# Altium project Audio Prj.PrjPcb
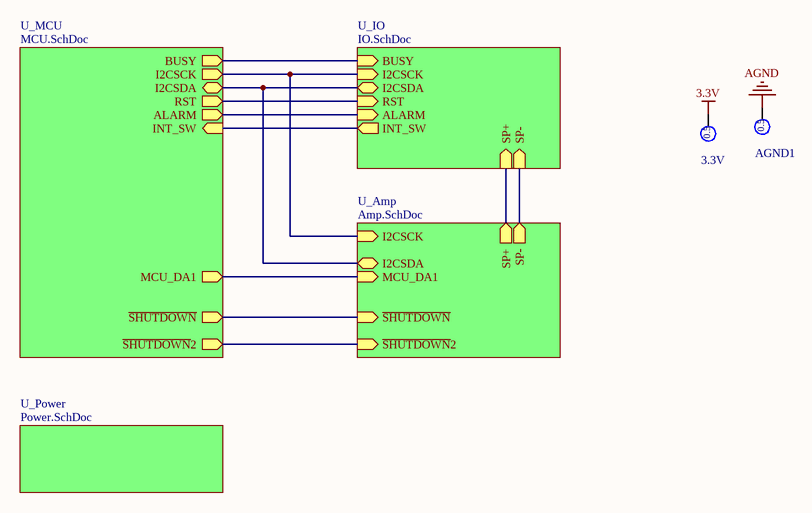
[diagram p0: TOP.SchDoc]
PRJ_Number: 202107; PRJ_Title: IHA-8001; SCH_Rev: 1.0
4 sheets, 186 parts. Net scope: hierarchical (ports join the sheet entries above them; power ports are global).
Board file: PCB2.PcbDoc
Sheets:
  TOP.SchDoc
    U_Amp = Amp.SchDoc
    U_Power = Power.SchDoc
    U_IO = IO.SchDoc

## Sheet TOP.SchDoc: CX1000 5V4A
size A4; Date: 2012/02/27; ApprovedBy: 稲村; DrawnBy: 猪鼻; DocumentNumber: Documentnumber; Revision: 1; SheetNumber: 1; SheetTotal: 5; BoardNumber: BoardNumber; PartsNumber: PartsNumber; DrawnDate: 2012/02/27; ApprovedDate: 2012/**/**

### Parts
3.3V  TP0.5mm  [TP0.5mm]  (value not drawn)  (no BOM)
AGND1  TP0.5mm  [TP0.5mm]  (value not drawn)  (no BOM)

### Sub-sheets
U_Amp = Amp.SchDoc: SP+ (out), SP- (out), MCU_DA1 (in), ~{SHUTDOWN} (in), I2CSCK (in), I2CSDA (bidir), ~{SHUTDOWN}2 (in)
U_IO = IO.SchDoc: SP+ (in), SP- (in), BUSY (in), I2CSCK (in), I2CSDA (bidir), INT_SW (out), RST (in), ALARM (in)
U_MCU = MCU.SchDoc (file not in this document): I2CSCK (out), I2CSDA (bidir), ALARM (out), BUSY (out), MCU_DA1 (out), RST (out), INT_SW (in), ~{SHUTDOWN} (out), ~{SHUTDOWN}2 (out)
U_Power = Power.SchDoc: no entries

### Nets
3.3V: 3.3V.1
AGND: AGND1.1
ALARM: sheet U_MCU/ALARM, sheet U_IO/ALARM
BUSY: sheet U_MCU/BUSY, sheet U_IO/BUSY
I2CSCK: sheet U_Amp/I2CSCK, sheet U_MCU/I2CSCK, sheet U_IO/I2CSCK
I2CSDA: sheet U_Amp/I2CSDA, sheet U_MCU/I2CSDA, sheet U_IO/I2CSDA
SP+: sheet U_Amp/SP+, sheet U_IO/SP+
SP-: sheet U_Amp/SP-, sheet U_IO/SP-
NetC58_1: sheet U_Amp/MCU_DA1, sheet U_MCU/MCU_DA1
NetR123_1: sheet U_Amp/~{SHUTDOWN}2, sheet U_MCU/~{SHUTDOWN}2
NetTR3_B: sheet U_Amp/~{SHUTDOWN}, sheet U_MCU/~{SHUTDOWN}
NetU6_14: sheet U_MCU/RST, sheet U_IO/RST
NetU6_16: sheet U_MCU/INT_SW, sheet U_IO/INT_SW

### Notes on the sheet
- Project Title:
- Project No:
- Size:
- Date:
- A4
- Rev:
- Page Title:
- Sheet:
- of
- (in symbol TP0.5mm) 0.5

### Library data of the parts
3.3V AGND1 = TP0.5mm: Test-Point 0.5mm

## Sheet Amp.SchDoc
size A4; SheetNumber: 4; SheetTotal: 5
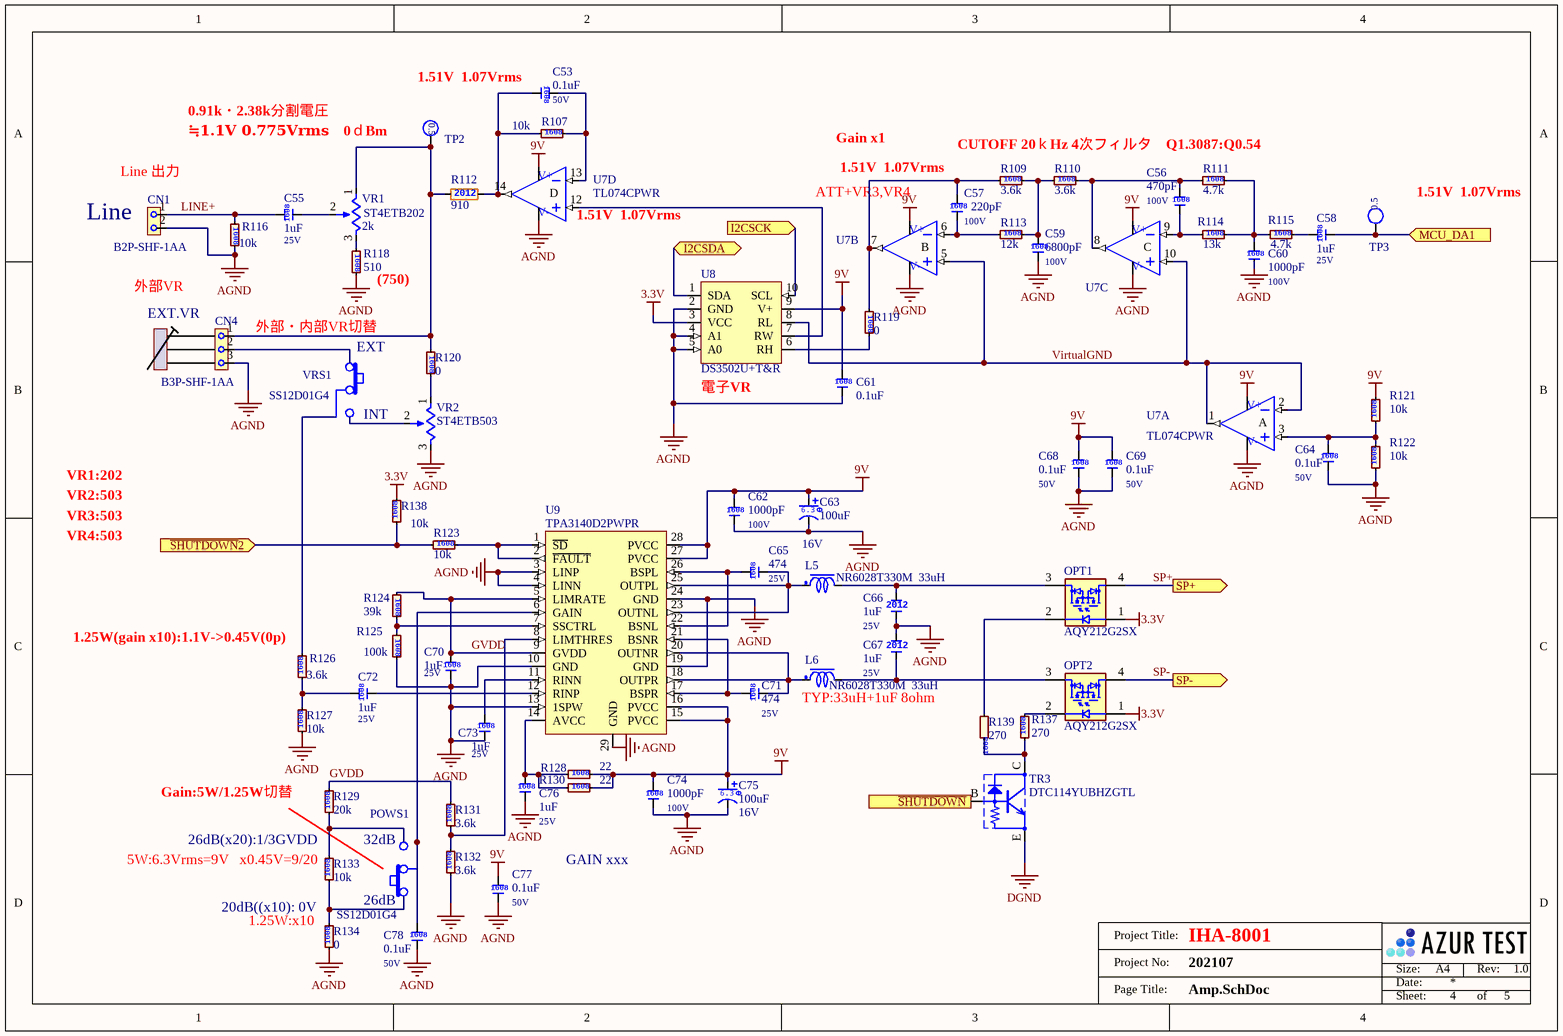
[diagram p1: Amp.SchDoc]

### Parts
C53  Tag: 0.1uF  Voltage: 50V  [C1608]  (hidden comment: CGA3E2X7R1H104K080AA)
C55  Tag: 1uF  Voltage: 25V  [C1608]  (hidden comment: TMK107BJ105MA-T)
C56  Tag: 470pF  Voltage: 100V  [C1608]  (hidden comment: GCM1885C2A471JA16D)
C57  Tag: 220pF  Voltage: 100V  [C1608]  (hidden comment: GCM1885C2A221JA16D)
C58  Tag: 1uF  Voltage: 25V  [C1608]  (hidden comment: TMK107BJ105MA-T)
C59  Tag: 6800pF  Voltage: 100V  [C1608]  (hidden comment: GCM1885C2A682JA16D)
C60  Tag: 1000pF  Voltage: 100V  [C1608]  (hidden comment: GCM1885C2A102JA16D)
C61  Tag: 0.1uF  [C1608]  (hidden comment: CGA3E2X7R1H104K080AA)
C62  Tag: 1000pF  Voltage: 100V  [C1608]  (hidden comment: GCM1885C2A102JA16D)
C63  Tag: 100uF  Voltage: 16V  [6.6mmX6.6mm]  (hidden comment: UCQ1C101MCL1GS)
C64  Tag: 0.1uF  Voltage: 50V  [C1608]  (hidden comment: CGA3E2X7R1H104K080AA)
C65  Tag: 474  Voltage: 25V  [C1608]  (hidden comment: UMK107B7474KA-TR)
C66  Tag: 1uF  Voltage: 25V  [C2012]  (hidden comment: TMK212BJ105KG-T)
C67  Tag: 1uF  Voltage: 25V  [C2012]  (hidden comment: TMK212BJ105KG-T)
C68  Tag: 0.1uF  Voltage: 50V  [C1608]  (hidden comment: CGA3E2X7R1H104K080AA)
C69  Tag: 0.1uF  Voltage: 50V  [C1608]  (hidden comment: CGA3E2X7R1H104K080AA)
C70  Tag: 1uF  Voltage: 25V  [C1608]  (hidden comment: TMK107BJ105MA-T)
C71  Tag: 474  Voltage: 25V  [C1608]  (hidden comment: UMK107B7474KA-TR)
C72  Tag: 1uF  Voltage: 25V  [C1608]  (hidden comment: TMK107BJ105MA-T)
C73  Tag: 1uF  Voltage: 25V  [C1608]  (hidden comment: TMK107BJ105MA-T)
C74  Tag: 1000pF  Voltage: 100V  [C1608]  (hidden comment: GCM1885C2A102JA16D)
C75  Tag: 100uF  Voltage: 16V  [6.6mmX6.6mm]  (hidden comment: UCQ1C101MCL1GS)
C76  Tag: 1uF  Voltage: 25V  [C1608]  (hidden comment: TMK107BJ105MA-T)
C77  Tag: 0.1uF  Voltage: 50V  [C1608]  (hidden comment: CGA3E2X7R1H104K080AA)
C78  Tag: 0.1uF  Voltage: 50V  [C1608]  (hidden comment: CGA3E2X7R1H104K080AA)
CN1  B2P-SHF-1AA  [B2P-SHF-1AA]
CN4  B3P-SHF-1AA  [B3P-SHF-1AA]
L5  NR6028T330M  33uH  [NR6028T]
L6  NR6028T330M  33uH  [NR6028T]
OPT1  AQY212G2SX  [SOP4-2.54]
OPT2  AQY212G2SX  [SOP4-2.54]
POWS1  SS12D01G4  [SS12D01G4]
R107  Tag: 10k  [R1608]  (hidden comment: ERJ-PA3F1002V)
R109  Tag: 3.6k  [R1608]  (hidden comment: ERJ-PA3F3601V)
R110  Tag: 3.6k  [R1608]  (hidden comment: ERJ-PA3F3601V)
R111  Tag: 4.7k  [R1608]  (hidden comment: ERJ-PA3F4701V)
R112  Tag: 910  [R2012]  (hidden comment: RK73B2ATTD911J)
R113  Tag: 12k  [R1608]  (hidden comment: ERJ-PA3F1201V)
R114  Tag: 13k  [R1608]  (hidden comment: ERJ-PA3F1302V)
R115  Tag: 4.7k  [R1608]  (hidden comment: ERJ-PA3F4701V)
R116  Tag: 10k  [R1608]  (hidden comment: ERJ-PA3F1002V)
R118  Tag: 510  [R1608]  (hidden comment: ERJ-PA3F5100V)
R119  Tag: 0  [R1608]  (hidden comment: RK73Z1JTTD)
R120  Tag: 0  [R1608]  (hidden comment: RK73Z1JTTD)
R121  Tag: 10k  [R1608]  (hidden comment: ERJ-PA3F1002V)
R122  Tag: 10k  [R1608]  (hidden comment: ERJ-PA3F1002V)
R123  Tag: 10k  [R1608]  (hidden comment: ERJ-PA3F1002V)
R124  Tag: 39k  [R1608]  (hidden comment: ERJ-PA3F3902V)
R125  Tag: 100k  [R1608]  (hidden comment: ERJ-PA3F1003V)
R126  Tag: 3.6k  [R1608]  (hidden comment: ERJ-PA3F3601V)
R127  Tag: 10k  [R1608]  (hidden comment: ERJ-PA3F1002V)
R128  Tag: 22  [R1608]  (hidden comment: ERJ-PA3F22R0V)
R129  Tag: 20k  [R1608]  (hidden comment: ERJ-PA3F2002V)
R130  Tag: 22  [R1608]  (hidden comment: ERJ-PA3F22R0V)
R131  Tag: 3.6k  [R1608]  (hidden comment: ERJ-PA3F3601V)
R132  Tag: 3.6k  [R1608]  (hidden comment: ERJ-PA3F3601V)
R133  Tag: 10k  [R1608]  (hidden comment: ERJ-PA3F1002V)
R134  Tag: 0  [R1608]  (hidden comment: RK73Z1JTTD)
R137  Tag: 270  [R1608]  (hidden comment: RR0816P-271-D)
R138  Tag: 10k  [R1608]  (hidden comment: ERJ-PA3F1002V)
R139  Tag: 270  [R1608]  (hidden comment: RR0816P-271-D)
TP2  TP0.5mm  [TP0.5mm]  (value not drawn)  (no BOM)
TP3  TP0.5mm  [TP0.5mm]  (value not drawn)  (no BOM)
TR3  DTC114YUBHZGTL  [SOT-323F]
U7  TL074CPWR  [TSSOP14]  (parts A,B,C,D of 4)
U8  DS3502U+T&R  [MSOP10]
U9  TPA3140D2PWPR  [TSSOP28]
VR1  ST4ETB202  Tag: 2k  [ST4ETB202]
VR2  ST4ETB503  [ST4ETB202]
VRS1  SS12D01G4  [SS12D01G4]

### Ports
I2CSCK (in), I2CSDA (bidir), MCU_DA1 (in), SP+ (out), SP- (out), ~{SHUTDOWN}2 (in), ~{SHUTDOWN} (in)

### Nets
3.3V: OPT1.1 OPT2.1 R138.2 U8.3(VCC)
9V: C61.2 C62.2 C63.+ C68.2 C69.2 C74.2 C75.+ C77.2 R121.2 R128.2 R130.2 U7.4(V+) U8.9(V+) U9.15(PVCC) U9.16(PVCC) U9.27(PVCC) U9.28(PVCC)
AGND: C59.1 C60.1 C61.1 C62.1 C63.- C64.1 C66.1 C67.2 C68.1 C69.1 C70.1 C73.1 C74.1 C75.- C76.1 C77.1 C78.1 CN1.2 CN4.3 R116.2 R118.2 R122.1 R125.2 R127.1 R132.1 R134.1 U7.11(V-) U8.2(GND) U8.4(A1) U8.5(A0) U9.3(LINP) U9.4(LINN) U9.10(GND) U9.13(1SPW) U9.19(GND) U9.24(GND) U9.29(GND) VR2.3
DGND: TR3.E
GVDD: C70.2 R124.1 R129.2 R131.2 U9.5(LIMRATE) U9.9(GVDD)
I2CSCK: U8.10(SCL) ; port I2CSCK
I2CSDA: U8.1(SDA) ; port I2CSDA
LINE+: C55.2 CN1.1 R116.1
SP+: OPT1.4 ; port SP+
SP-: OPT2.4 ; port SP-
VirtualGND: U7.1(OUT) U7.2(IN-) U7.5(IN+) U7.10(IN+) U8.8(RL)
NetC53_1: C53.1 R107.1 R112.2 U7.14(OUT)
NetC53_2: C53.2 R107.2 U7.13(IN-)
NetC55_1: C55.1 VR1.2
NetC56_1: C56.1 R114.1 U7.9(IN-)
NetC56_2: C56.2 R110.2 R111.1 U7.8(OUT)
NetC57_1: C57.1 R113.1 U7.6(IN-)
NetC57_2: C57.2 R109.1 R119.1 U7.7(OUT)
NetC58_1: C58.1 TP3.1 ; port MCU_DA1
NetC58_2: C58.2 R115.2
NetC59_2: C59.2 R109.2 R110.1 R113.2
NetC60_2: C60.2 R111.2 R114.2 R115.1
NetC64_2: C64.2 R121.1 R122.2 U7.3(IN+)
NetC65_1: C65.1 L5.1 U9.23(OUTNL) U9.25(OUTPL)
NetC65_2: C65.2 U9.22(BSNL) U9.26(BSPL)
NetC66_2: C66.2 L5.2 OPT1.3
NetC67_1: C67.1 L6.2 OPT2.3
NetC71_1: C71.1 L6.1 U9.18(OUTPR) U9.20(OUTNR)
NetC71_2: C71.2 U9.17(BSPR) U9.21(BSNR)
NetC72_1: C72.1 U9.12(RINP)
NetC72_2: C72.2 R126.1 R127.2
NetC73_2: C73.2 U9.11(RINN)
NetC76_2: C76.2 R128.1 R130.1 U9.14(AVCC)
NetC78_2: C78.2 POWS1.2 U9.6(GAIN)
NetCN4_1: CN4.1 R112.1 R120.1 TP2.1 VR1.1
NetCN4_2: CN4.2 VRS1.1
NetOPT1_2: OPT1.2 R139.2
NetOPT2_2: OPT2.2 R137.2
NetPOWS1_1: POWS1.1 R133.1 R134.2
NetPOWS1_3: POWS1.3 R129.1 R133.2
NetR118_1: R118.1 VR1.3
NetR119_2: R119.2 U8.6(RH)
NetR120_2: R120.2 VR2.1
NetR123_1: R123.1 R138.1 ; port ~{SHUTDOWN}2
NetR123_2: R123.2 U9.1(~{SD}) U9.2(~{FAULT})
NetR124_2: R124.2 R125.1 U9.7(SSCTRL)
NetR126_2: R126.2 VRS1.2
NetR131_1: R131.1 R132.2 U9.8(LIMTHRES)
NetR137_1: R137.1 R139.1 TR3.C
NetTR3_B: TR3.B(IN) ; port ~{SHUTDOWN}
NetU7_12: U7.12(IN+) U8.7(RW)
NetVR2_2: VR2.2 VRS1.3

### Notes on the sheet
- 0.91k・2.38k分割電圧
- (near C53) 1.51V  1.07Vrms
- (near CN1) Line 出力
- ≒1.1V 0.775Vrms　0ｄBm
- Gain x1
- (near C57) 1.51V  1.07Vrms
- CUTOFF 20ｋHz 4次フィルタ　Q1.3087:Q0.54
- (near CN1) Line
- (near U7) 1.51V  1.07Vrms
- ATT+VR3,VR4
- (near TP3) 1.51V  1.07Vrms
- 外部VR
- (near R118) (750)
- (near CN4) EXT.VR
- 外部・内部VR切替
- (near VRS1) EXT
- (near VRS1) INT
- (near U8) 電子VR
- VR1:202
- VR2:503
- VR3:503
- VR4:503
- (near R126) 1.25W(gain x10):1.1V->0.45V(0p)
- (near L6) TYP:33uH+1uF 8ohm
- Gain:5W/1.25W切替
- 26dB(x20):1/3GVDD
- (near POWS1) 32dB
- (near R133) 5W:6.3Vrms=9V   x0.45V=9/20
- (near R134) 20dB((x10): 0V
- (near R134) 1.25W:x10
- (near POWS1) 26dB
- GAIN xxx
- Project Title:
- Project No:
- Size:
- Date:
- A4
- Rev:
- Page Title:
- Sheet:
- of
- (in symbol 6.6 X 6.6) ６.３Φ
- (in symbol C1608) 1608
- (in symbol C2012) 2012
- (in symbol MF2012) 2012
- (in symbol TF1608) 1608
- (in symbol TL084CPT, part A) A
- (in symbol TL084CPT, part B) B
- (in symbol TL084CPT, part C) C
- (in symbol TL084CPT, part D) D
- (in symbol TP0.5mm) 0.5

### Library data of the parts
C53 C64 C68 C69 C77 C78 = C1608: セラコン1608サイズ; Vendor: TDK
C55 C58 C70 C72 C73 C76 = C1608: セラコン1608サイズ; Vendor: TaiyoYuden
C56 C57 C59 C60 C62 C74 = C1608: セラコン1608サイズ; Vendor: Murata
C61 = C1608: セラコン1608サイズ; Vendor: TDK; Voltage: 50V
C63 C75 = 6.6 X 6.6: 6.3φ 電解コンデンサ; Vendor: Nichicon
C65 C71 = C1608: セラコン1608サイズ; Vendor: TiyoYuden
C66 C67 = C2012: セラコン2012サイズ; Vendor: Taiyo Yuden
CN1 = B2P-SHF-1AA: 雄,ストレート,1列2ピン; Vendor: JST
CN4 = B3P-SHF-1AA: 雄,ストレート,1列3ピン; Vendor: JST
L5 L6 = DR125: Shielded Inductor; Vendor: Taiyo Yuden; Tag: 33uH
OPT1 OPT2 = AQY225R2S: 60V 550mA フォトモス; Vendor: Panasonic
POWS1 VRS1 = SS12D01G4: SPDTスライドスイッチ; Vendor: 秋月¦
R107 R109-R111 R113-R116 R118 R121-R133 R137-R139 = TF1608: 厚膜チップ抵抗1608サイズ; Vendor: Panasonic
R112 = MF2012: 薄膜チップ抵抗2012サイズ; Vendor: KOA
R119 R120 R134 = TF1608: 厚膜チップ抵抗1608サイズ; Vendor: KOA
TP2 TP3 = TP0.5mm: Test-Point 0.5mm
TR3 = DTC114YUBHZGTL: NPN  TR 0.1A SC85 2x2.1 SOC323; Vendor: ROHM ローム
U7 = TL084CPT: IC OPAMP JFET 4 CIRCUIT 14TSSOP; Vendor: Texas Instruments
U8 = DS3502U+T&R: IC DGTL POT 10KOHM 128TAP 10UMAX; Vendor: Maxim Integrated
U9 = TPA3140D2PWPR: IC AMP CLASS D STER 10W 28HTSSOP; Vendor: Texas Instruments
VR1 = ST-32EA**: CERMET TRIMMER  Top adjustmet; Vendor: Nidec Copal Electronics
VR2 = ST-32EA**: CERMET TRIMMER  Top adjustmet; Vendor: Nidec Copal Electronics; Tag: 50k

## Sheet Power.SchDoc
size A4; SheetNumber: 2; SheetTotal: 5
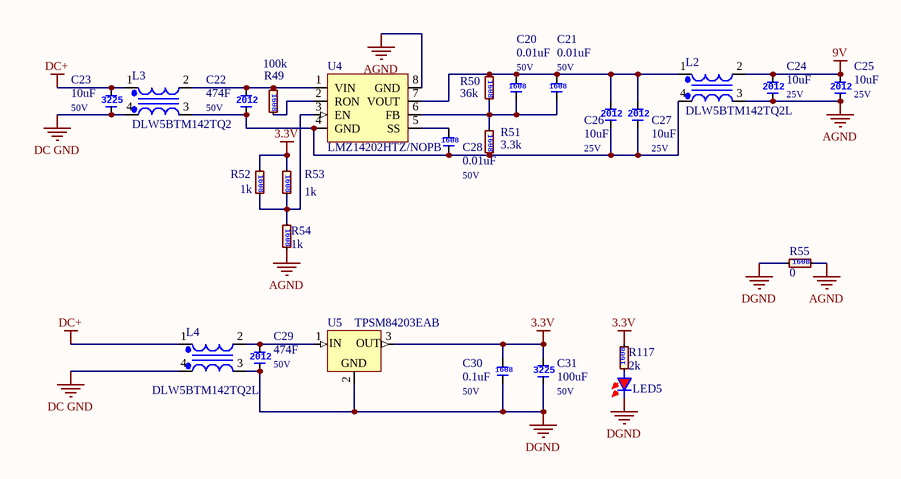
[diagram p2: Power.SchDoc]

### Parts
C20  Tag: 0.01uF  Voltage: 50V  [C1608]  (hidden comment: GCD188R71H103KA01D)
C21  Tag: 0.01uF  Voltage: 50V  [C1608]  (hidden comment: GCD188R71H103KA01D)
C22  Tag: 474F  Voltage: 50V  [C2012]  (hidden comment: GRM21BR71H474MA88)
C23  Tag: 10uF  Voltage: 50V  [C3225]  (hidden comment: UMK325C7106MM-T)
C24  Tag: 10uF  Voltage: 25V  [C2012]  (hidden comment: TMK212BBJ106MG-T)
C25  Tag: 10uF  Voltage: 25V  [C2012]  (hidden comment: TMK212BBJ106MG-T)
C26  Tag: 10uF  Voltage: 25V  [C2012]  (hidden comment: TMK212BBJ106MG-T)
C27  Tag: 10uF  Voltage: 25V  [C2012]  (hidden comment: TMK212BBJ106MG-T)
C28  Tag: 0.01uF  Voltage: 50V  [C1608]  (hidden comment: GCD188R71H103KA01D)
C29  Tag: 474F  Voltage: 50V  [C2012]  (hidden comment: GRM21BR71H474MA88)
C30  Tag: 0.1uF  Voltage: 50V  [C1608]  (hidden comment: CGA3E2X7R1H104K080AA)
C31  Tag: 100uF  Voltage: 50V  [C3225]  (hidden comment: EMK325ABJ107MM-T)
L2  DLW5BTM142TQ2L  [DLW5BTM]
L3  DLW5BTM142TQ2  [DLW5BTM]
L4  DLW5BTM142TQ2L  [DLW5BTM]
LED5  APT1608LSECK/J4-PRV  [LED1608]  (value not drawn)
R49  Tag: 100k  [R1608]  (hidden comment: ERJ-PA3F1003V)
R50  Tag: 36k  [R1608]  (hidden comment: ERJ-PA3F3602V)
R51  Tag: 3.3k  [R1608]  (hidden comment: ERJ-PA3F3301V)
R52  Tag: 1k  [R1608]  (hidden comment: ERJ-PA3F1001V)
R53  Tag: 1k  [R1608]  (hidden comment: ERJ-PA3F1001V)
R54  Tag: 1k  [R1608]  (hidden comment: ERJ-PA3F1001V)
R55  Tag: 0  [R1608]  (hidden comment: RK73Z1JTTD)
R117  Tag: 2k  [R1608]  (hidden comment: ERJ-PA3F2001V)
U4  LMZ14202HTZ/NOPB  [TO-PMOD-7]
U5  TPSM84203EAB  [TO220-3]

### Nets
3.3V: C30.2 C31.2 R52.1 R53.1 R117.2 U5.3(OUT)
9V: C24.2 C25.2 L2.2(Pri+)
AGND: C24.1 C25.1 L2.3(Pri-) R54.2 R55.2 U4.8(GND)
DC GND: C23.1 L3.4(Sec-) L4.4(Sec-)  [project net DC_GND]
DC+: C23.2 L3.1(Sec+) L4.1(Sec+)
DGND: C29.1 C30.1 C31.1 L4.3(Pri-) LED5.K R55.1 U5.2(GND)
NetC20_1: C20.1 C21.1 R50.2 R51.1 U4.6(FB)
NetC20_2: C20.2 C21.2 C26.2 C27.2 L2.1(Sec+) R50.1 U4.7(VOUT)
NetC22_1: C22.1 C26.1 C27.1 C28.1 L2.4(Sec-) L3.3(Pri-) R51.2 U4.4(GND)
NetC22_2: C22.2 L3.2(Pri+) R49.1 U4.1(VIN)
NetC28_2: C28.2 U4.5(SS)
NetC29_2: C29.2 L4.2(Pri+) U5.1(IN)
NetLED5_A: LED5.A R117.1
NetR49_2: R49.2 U4.2(RON)
NetR52_2: R52.2 R53.2 R54.1 U4.3(EN)

### Notes on the sheet
- Project Title:
- Project No:
- Size:
- Date:
- A4
- Rev:
- Page Title:
- Sheet:
- of
- (in symbol C1608) 1608
- (in symbol C2012) 2012
- (in symbol C3225) 3225
- (in symbol TF1608) 1608

### Library data of the parts
C20 C21 C28 = C1608: セラコン1608サイズ; Vendor: Murata
C22 C24-C27 C29 = C2012: セラコン2012サイズ; Vendor: Murata
C23 C31 = C3225: セラコン3225サイズ; Vendor: TaiyoYuden
C30 = C1608: セラコン1608サイズ; Vendor: TDK
L2-L4 = ACM3225: コモンモード,1A,4ピン; Vendor: Murata
LED5 = LTST-C190CKT: LED 1608 orange; Vendor: kingbright; Color: Orange
R49-R54 R117 = TF1608: 厚膜チップ抵抗1608サイズ; Vendor: Panasonic
R55 = TF1608: 厚膜チップ抵抗1608サイズ; Vendor: KOA
U4 = LMZ14202HTZ/NOPB: DC DC CONVERTER 5-30V; Vendor: Texas Instruments
U5 = TPSM84203EAB: DC DC CONVERTER 3.3V; Vendor: Texas Instruments

## Sheet IO.SchDoc
size A4; SheetNumber: 5; SheetTotal: 5
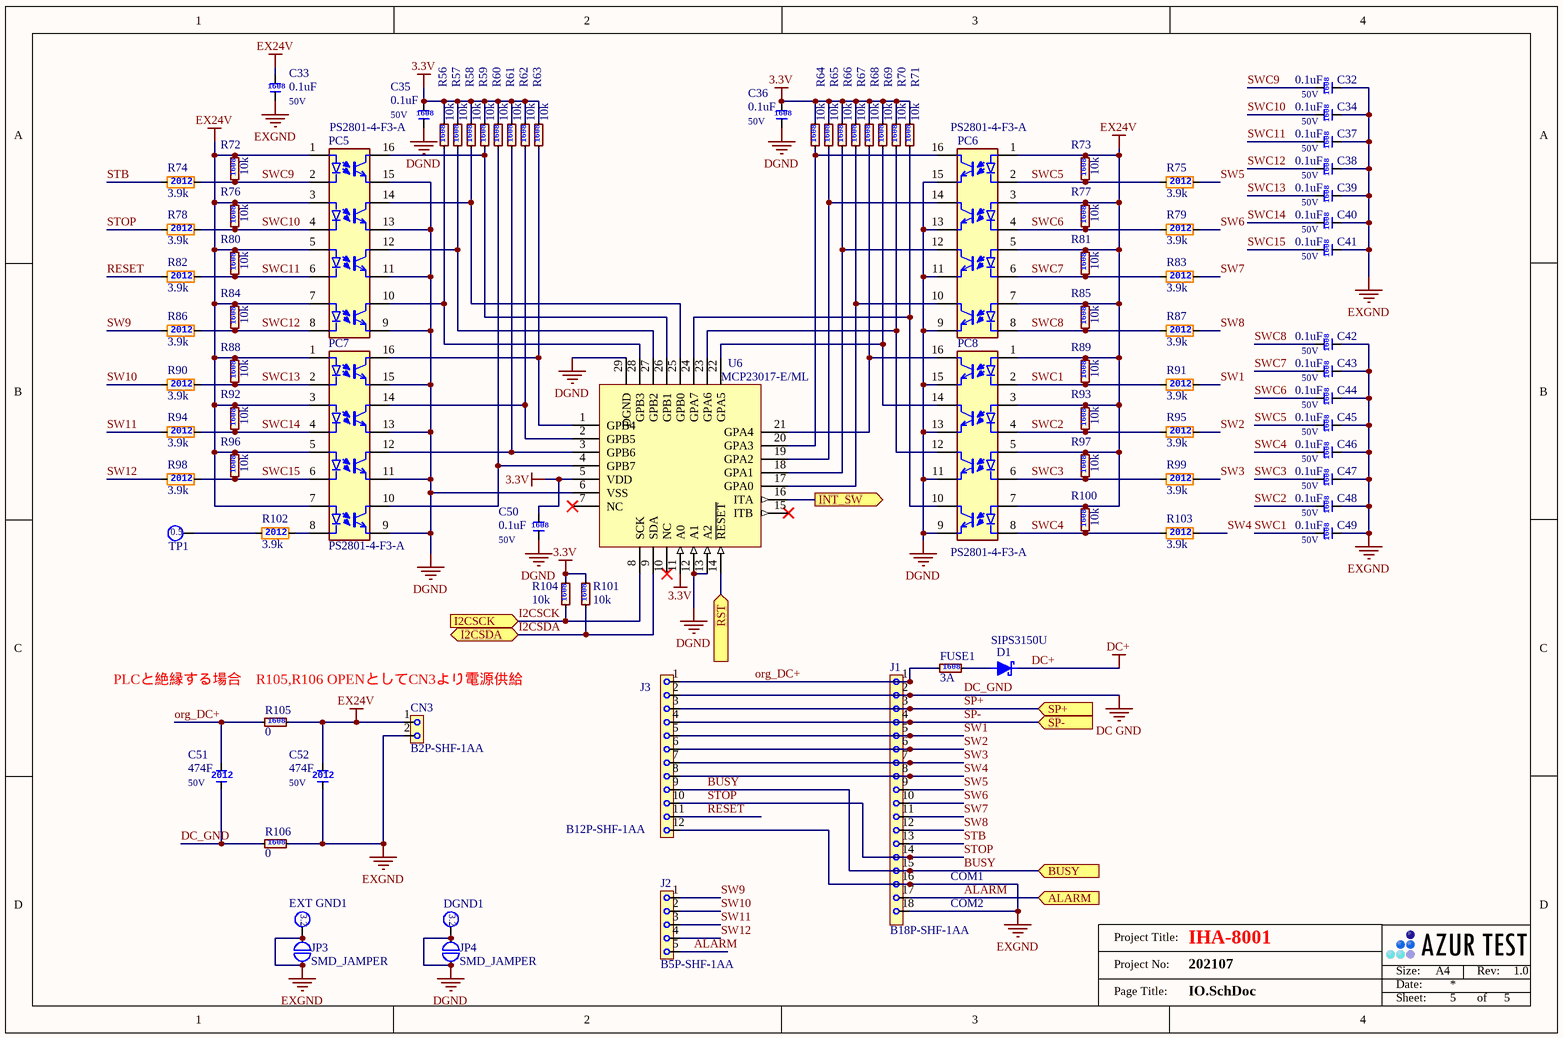
[diagram p3: IO.SchDoc]

### Parts
C32  Tag: 0.1uF  Voltage: 50V  [C1608]  (hidden comment: CGA3E2X7R1H104K080AA)
C33  Tag: 0.1uF  Voltage: 50V  [C1608]  (hidden comment: CGA3E2X7R1H104K080AA)
C34  Tag: 0.1uF  Voltage: 50V  [C1608]  (hidden comment: CGA3E2X7R1H104K080AA)
C35  Tag: 0.1uF  Voltage: 50V  [C1608]  (hidden comment: CGA3E2X7R1H104K080AA)
C36  Tag: 0.1uF  Voltage: 50V  [C1608]  (hidden comment: CGA3E2X7R1H104K080AA)
C37  Tag: 0.1uF  Voltage: 50V  [C1608]  (hidden comment: CGA3E2X7R1H104K080AA)
C38  Tag: 0.1uF  Voltage: 50V  [C1608]  (hidden comment: CGA3E2X7R1H104K080AA)
C39  Tag: 0.1uF  Voltage: 50V  [C1608]  (hidden comment: CGA3E2X7R1H104K080AA)
C40  Tag: 0.1uF  Voltage: 50V  [C1608]  (hidden comment: CGA3E2X7R1H104K080AA)
C41  Tag: 0.1uF  Voltage: 50V  [C1608]  (hidden comment: CGA3E2X7R1H104K080AA)
C42  Tag: 0.1uF  Voltage: 50V  [C1608]  (hidden comment: CGA3E2X7R1H104K080AA)
C43  Tag: 0.1uF  Voltage: 50V  [C1608]  (hidden comment: CGA3E2X7R1H104K080AA)
C44  Tag: 0.1uF  Voltage: 50V  [C1608]  (hidden comment: CGA3E2X7R1H104K080AA)
C45  Tag: 0.1uF  Voltage: 50V  [C1608]  (hidden comment: CGA3E2X7R1H104K080AA)
C46  Tag: 0.1uF  Voltage: 50V  [C1608]  (hidden comment: CGA3E2X7R1H104K080AA)
C47  Tag: 0.1uF  Voltage: 50V  [C1608]  (hidden comment: CGA3E2X7R1H104K080AA)
C48  Tag: 0.1uF  Voltage: 50V  [C1608]  (hidden comment: CGA3E2X7R1H104K080AA)
C49  Tag: 0.1uF  Voltage: 50V  [C1608]  (hidden comment: CGA3E2X7R1H104K080AA)
C50  Tag: 0.1uF  Voltage: 50V  [C1608]  (hidden comment: CGA3E2X7R1H104K080AA)
C51  Tag: 474F  Voltage: 50V  [C2012]  (hidden comment: GRM21BR71H474MA88)
C52  Tag: 474F  Voltage: 50V  [C2012]  (hidden comment: GRM21BR71H474MA88)
CN3  B2P-SHF-1AA  [B2P-SHF-1AA]
D1  SIPS3150U  [DO-214AA]
DGND1  TP3.2mm  [TP3.2mm]  (value not drawn)  (no BOM)
EXT_GND1  TP3.2mm  [TP3.2mm]  (value not drawn)  (no BOM)
FUSE1  Tag: 3A  [R1608]  (hidden comment: ERB-RE3R00V)
J1  B18P-SHF-1AA  [B18P-SHF-1AA]
J2  B5P-SHF-1AA  [B5P-SHF-1AA]
J3  B12P-SHF-1AA  [B12P-SHF-1AA]
JP3  SMD_JAMPER  [SMD_JAMPER -Cut]  (no BOM)
JP4  SMD_JAMPER  [SMD_JAMPER -Cut]  (no BOM)
PC5  PS2801-4-F3-A  [SO16]
PC6  PS2801-4-F3-A  [SO16]
PC7  PS2801-4-F3-A  [SO16]
PC8  PS2801-4-F3-A  [SO16]
R56  Tag: 10k  [R1608]  (hidden comment: ERJ-PA3F1002V)
R57  Tag: 10k  [R1608]  (hidden comment: ERJ-PA3F1002V)
R58  Tag: 10k  [R1608]  (hidden comment: ERJ-PA3F1002V)
R59  Tag: 10k  [R1608]  (hidden comment: ERJ-PA3F1002V)
R60  Tag: 10k  [R1608]  (hidden comment: ERJ-PA3F1002V)
R61  Tag: 10k  [R1608]  (hidden comment: ERJ-PA3F1002V)
R62  Tag: 10k  [R1608]  (hidden comment: ERJ-PA3F1002V)
R63  Tag: 10k  [R1608]  (hidden comment: ERJ-PA3F1002V)
R64  Tag: 10k  [R1608]  (hidden comment: ERJ-PA3F1002V)
R65  Tag: 10k  [R1608]  (hidden comment: ERJ-PA3F1002V)
R66  Tag: 10k  [R1608]  (hidden comment: ERJ-PA3F1002V)
R67  Tag: 10k  [R1608]  (hidden comment: ERJ-PA3F1002V)
R68  Tag: 10k  [R1608]  (hidden comment: ERJ-PA3F1002V)
R69  Tag: 10k  [R1608]  (hidden comment: ERJ-PA3F1002V)
R70  Tag: 10k  [R1608]  (hidden comment: ERJ-PA3F1002V)
R71  Tag: 10k  [R1608]  (hidden comment: ERJ-PA3F1002V)
R72  Tag: 10k  [R1608]  (hidden comment: ERJ-PA3F1002V)
R73  Tag: 10k  [R1608]  (hidden comment: ERJ-PA3F1002V)
R74  Tag: 3.9k  [R2012]  (hidden comment: RK73B2ATTD392J)
R75  Tag: 3.9k  [R2012]  (hidden comment: RK73B2ATTD392J)
R76  Tag: 10k  [R1608]  (hidden comment: ERJ-PA3F1002V)
R77  Tag: 10k  [R1608]  (hidden comment: ERJ-PA3F1002V)
R78  Tag: 3.9k  [R2012]  (hidden comment: RK73B2ATTD392J)
R79  Tag: 3.9k  [R2012]  (hidden comment: RK73B2ATTD392J)
R80  Tag: 10k  [R1608]  (hidden comment: ERJ-PA3F1002V)
R81  Tag: 10k  [R1608]  (hidden comment: ERJ-PA3F1002V)
R82  Tag: 3.9k  [R2012]  (hidden comment: RK73B2ATTD392J)
R83  Tag: 3.9k  [R2012]  (hidden comment: RK73B2ATTD392J)
R84  Tag: 10k  [R1608]  (hidden comment: ERJ-PA3F1002V)
R85  Tag: 10k  [R1608]  (hidden comment: ERJ-PA3F1002V)
R86  Tag: 3.9k  [R2012]  (hidden comment: RK73B2ATTD392J)
R87  Tag: 3.9k  [R2012]  (hidden comment: RK73B2ATTD392J)
R88  Tag: 10k  [R1608]  (hidden comment: ERJ-PA3F1002V)
R89  Tag: 10k  [R1608]  (hidden comment: ERJ-PA3F1002V)
R90  Tag: 3.9k  [R2012]  (hidden comment: RK73B2ATTD392J)
R91  Tag: 3.9k  [R2012]  (hidden comment: RK73B2ATTD392J)
R92  Tag: 10k  [R1608]  (hidden comment: ERJ-PA3F1002V)
R93  Tag: 10k  [R1608]  (hidden comment: ERJ-PA3F1002V)
R94  Tag: 3.9k  [R2012]  (hidden comment: RK73B2ATTD392J)
R95  Tag: 3.9k  [R2012]  (hidden comment: RK73B2ATTD392J)
R96  Tag: 10k  [R1608]  (hidden comment: ERJ-PA3F1002V)
R97  Tag: 10k  [R1608]  (hidden comment: ERJ-PA3F1002V)
R98  Tag: 3.9k  [R2012]  (hidden comment: RK73B2ATTD392J)
R99  Tag: 3.9k  [R2012]  (hidden comment: RK73B2ATTD392J)
R100  Tag: 10k  [R1608]  (hidden comment: ERJ-PA3F1002V)
R101  Tag: 10k  [R1608]  (hidden comment: ERJ-PA3F1002V)
R102  Tag: 3.9k  [R2012]  (hidden comment: RK73B2ATTD392J)
R103  Tag: 3.9k  [R2012]  (hidden comment: RK73B2ATTD392J)
R104  Tag: 10k  [R1608]  (hidden comment: ERJ-PA3F1002V)
R105  Tag: 0  [R1608]  (hidden comment: RK73Z1JTTD)
R106  Tag: 0  [R1608]  (hidden comment: RK73Z1JTTD)
TP1  TP0.5mm  [TP0.5mm]  (value not drawn)  (no BOM)
U6  MCP23017-E/ML  [QFN28]

### Ports
ALARM (in), BUSY (in), I2CSCK (in), I2CSDA (bidir), INT_SW (out), RST (in), SP+ (in), SP- (in)

### Nets
3.3V: C35.2 C36.2 C50.2 R56.2 R57.2 R58.2 R59.2 R60.2 R61.2 R62.2 R63.2 R64.2 R65.2 R66.2 R67.2 R68.2 R69.2 R70.2 R71.2 R101.2 R104.2 U6.5(VDD) U6.11(A0)
DC+: D1.K
DC_GND: C51.1 J1.2 J3.2 R106.1  [also labelled DC GND]
DGND: C35.1 C36.1 C50.1 DGND1.1 JP4.1 JP4.2 PC5.9(E) PC5.11(E) PC5.13(E) PC5.15(E) PC6.9(E) PC6.11(E) PC6.13(E) PC6.15(E) PC7.9(E) PC7.11(E) PC7.13(E) PC7.15(E) PC8.9(E) PC8.11(E) PC8.13(E) PC8.15(E) U6.6(VSS) U6.12(A1) U6.13(A2) U6.29(DGND)
EX24V: C33.2 C52.2 CN3.1 PC5.1(A-LED) PC5.3(A-LED) PC5.5(A-LED) PC5.7(A-LED) PC6.1(A-LED) PC6.3(A-LED) PC6.5(A-LED) PC6.7(A-LED) PC7.1(A-LED) PC7.3(A-LED) PC7.5(A-LED) PC7.7(A-LED) PC8.1(A-LED) PC8.3(A-LED) PC8.5(A-LED) PC8.7(A-LED) R72.2 R73.2 R76.2 R77.2 R80.2 R81.2 R84.2 R85.2 R88.2 R89.2 R92.2 R93.2 R96.2 R97.2 R100.2 R105.2
EXGND: C32.1 C33.1 C34.1 C37.1 C38.1 C39.1 C40.1 C41.1 C42.1 C43.1 C44.1 C45.1 C46.1 C47.1 C48.1 C49.1 C52.1 CN3.2 EXT_GND1.1 J1.16 J1.18 J3.12 JP3.1 JP3.2 R106.2
ALARM: J1.17 J2.5 ; port ALARM
BUSY: J1.15 J3.9 ; port BUSY
I2CSCK: R104.1 U6.8(SCK) ; port I2CSCK
I2CSDA: R101.1 U6.9(SDA) ; port I2CSDA
org_DC+: C51.2 FUSE1.1 J1.1 J3.1 R105.1
RESET: J3.11 R82.1
SP+: J1.3 J3.3 ; port SP+
SP-: J1.4 J3.4 ; port SP-
STB: J1.13 R74.1
STOP: J1.14 J3.10 R78.1
SW1: J1.5 J3.5 R91.2
SW2: J1.6 J3.6 R95.2
SW3: J1.7 J3.7 R99.2
SW4: J1.8 J3.8 R103.2
SW5: J1.9 R75.2
SW6: J1.10 R79.2
SW7: J1.11 R83.2
SW8: J1.12 R87.2
SW9: J2.1 R86.1
SW10: J2.2 R90.1
SW11: J2.3 R94.1
SW12: J2.4 R98.1
SWC1: C49.2 PC8.2(K-LED) R89.1 R91.1
SWC2: C48.2 PC8.4(K-LED) R93.1 R95.1
SWC3: C47.2 PC8.6(K-LED) R97.1 R99.1
SWC4: C46.2 PC8.8(K-LED) R100.1 R103.1
SWC5: C45.2 PC6.2(K-LED) R73.1 R75.1
SWC6: C44.2 PC6.4(K-LED) R77.1 R79.1
SWC7: C43.2 PC6.6(K-LED) R81.1 R83.1
SWC8: C42.2 PC6.8(K-LED) R85.1 R87.1
SWC9: C32.2 PC5.2(K-LED) R72.1 R74.2
SWC10: C34.2 PC5.4(K-LED) R76.1 R78.2
SWC11: C37.2 PC5.6(K-LED) R80.1 R82.2
SWC12: C38.2 PC5.8(K-LED) R84.1 R86.2
SWC13: C39.2 PC7.2(K-LED) R88.1 R90.2
SWC14: C40.2 PC7.4(K-LED) R92.1 R94.2
SWC15: C41.2 PC7.6(K-LED) R96.1 R98.2
NetD1_A: D1.A FUSE1.2
NetPC5_10: PC5.10(C) R56.1 U6.28(GPB3)
NetPC5_12: PC5.12(C) R57.1 U6.27(GPB2)
NetPC5_14: PC5.14(C) R58.1 U6.25(GPB0)
NetPC5_16: PC5.16(C) R59.1 U6.26(GPB1)
NetPC6_10: PC6.10(C) R67.1 U6.17(GPA0)
NetPC6_12: PC6.12(C) R66.1 U6.18(GPA1)
NetPC6_14: PC6.14(C) R65.1 U6.19(GPA2)
NetPC6_16: PC6.16(C) R64.1 U6.20(GPA3)
NetPC7_8: PC7.8(K-LED) R102.2
NetPC7_10: PC7.10(C) R60.1 U6.4(GPB7)
NetPC7_12: PC7.12(C) R61.1 U6.3(GPB6)
NetPC7_14: PC7.14(C) R62.1 U6.2(GPB5)
NetPC7_16: PC7.16(C) R63.1 U6.1(GPB4)
NetPC8_10: PC8.10(C) R71.1 U6.24(GPA7)
NetPC8_12: PC8.12(C) R70.1 U6.23(GPA6)
NetPC8_14: PC8.14(C) R69.1 U6.22(GPA5)
NetPC8_16: PC8.16(C) R68.1 U6.21(GPA4)
NetR102_1: R102.1 TP1.1
NetU6_14: U6.14(~{RESET}) ; port RST
NetU6_16: U6.16(ITA) ; port INT_SW

Not connected (* = marked no-connect by the designer): U6 7(NC)* 10(NC)* 15(ITB)*

### Notes on the sheet
- PLCと絶縁する場合　R105,R106 OPENとしてCN3より電源供給
- (near J1) COM2
- (near J1) COM1
- Project Title:
- Project No:
- Size:
- Date:
- A4
- Rev:
- Page Title:
- Sheet:
- of
- (in symbol C1608) 1608
- (in symbol C2012) 2012
- (in symbol MF2012) 2012
- (in symbol TF1608) 1608
- (in symbol TP0.5mm) 0.5
- (in symbol TP3.2mm) 3.2

### Library data of the parts
C32-C50 = C1608: セラコン1608サイズ; Vendor: TDK
C51 C52 = C2012: セラコン2012サイズ; Vendor: Murata
CN3 = B2P-SHF-1AA: 雄,ストレート,1列2ピン; Vendor: JST
D1 = Diode SMB 5.4x4.3: Schottky Rectifier; Vendor: STmicro; Voltage: 150V; Current: 3A
DGND1 EXT_GND1 = TP3.2mm: Test-Point 3.2mm
FUSE1 = TF1608: 3A 1608サイズ; Vendor: Panasonic
J1 = B18P-SHF-1AA: 雄,ストレート,1列12ピン PCB; Vendor: JST
J2 = B5P-SHF-1AA: 雄,ストレート,1列3ピン; Vendor: JST
J3 = B12P-SHF-1AA: 雄,ストレート,1列12ピン PCB; Vendor: JST
PC5-PC8 = TLP621: 4 Channel 16-SO; Vendor: Renesas
R56-R73 R76 R77 R80 R81 R84 R85 R88 R89 R92 R93 R96 R97 R100 R101 R104 = TF1608: 厚膜チップ抵抗1608サイズ; Vendor: Panasonic
R74 R75 R78 R79 R82 R83 R86 R87 R90 R91 R94 R95 R98 R99 R102 R103 = MF2012: 薄膜チップ抵抗2012サイズ; Vendor: KOA
R105 R106 = TF1608: 厚膜チップ抵抗1608サイズ; Vendor: KOA
TP1 = TP0.5mm: Test-Point 0.5mm
U6 = MCP23017-E/ML: I/O Expander 16 SPI 10MHz 28-SOIC; Vendor: Microchip Technology

## Nets that join several sheets
3.3V: TOP (3.3V.1), Amp (OPT1.1 OPT2.1 R138.2 U8.3), Power (6 pins), IO (23 pins)
9V: Amp (17 pins), Power (C24.2 C25.2 L2.2)
AGND: TOP (AGND1.1), Amp (38 pins), Power (6 pins)
DC+: Power (C23.2 L3.1 L4.1), IO (D1.K)
DC_GND: Power (C23.1 L3.4 L4.4), IO (C51.1 J1.2 J3.2 R106.1)
DGND: Amp (TR3.E), Power (7 pins), IO (26 pins)
I2CSCK: Amp (U8.10), IO (R104.1 U6.8)
I2CSDA: Amp (U8.1), IO (R101.1 U6.9)
SP+: Amp (OPT1.4), IO (J1.3 J3.3)
SP-: Amp (OPT2.4), IO (J1.4 J3.4)